# Altium schematic sheet MagicWandFinal.SchDoc
size A4; SheetNumber: 1; SheetTotal: 1
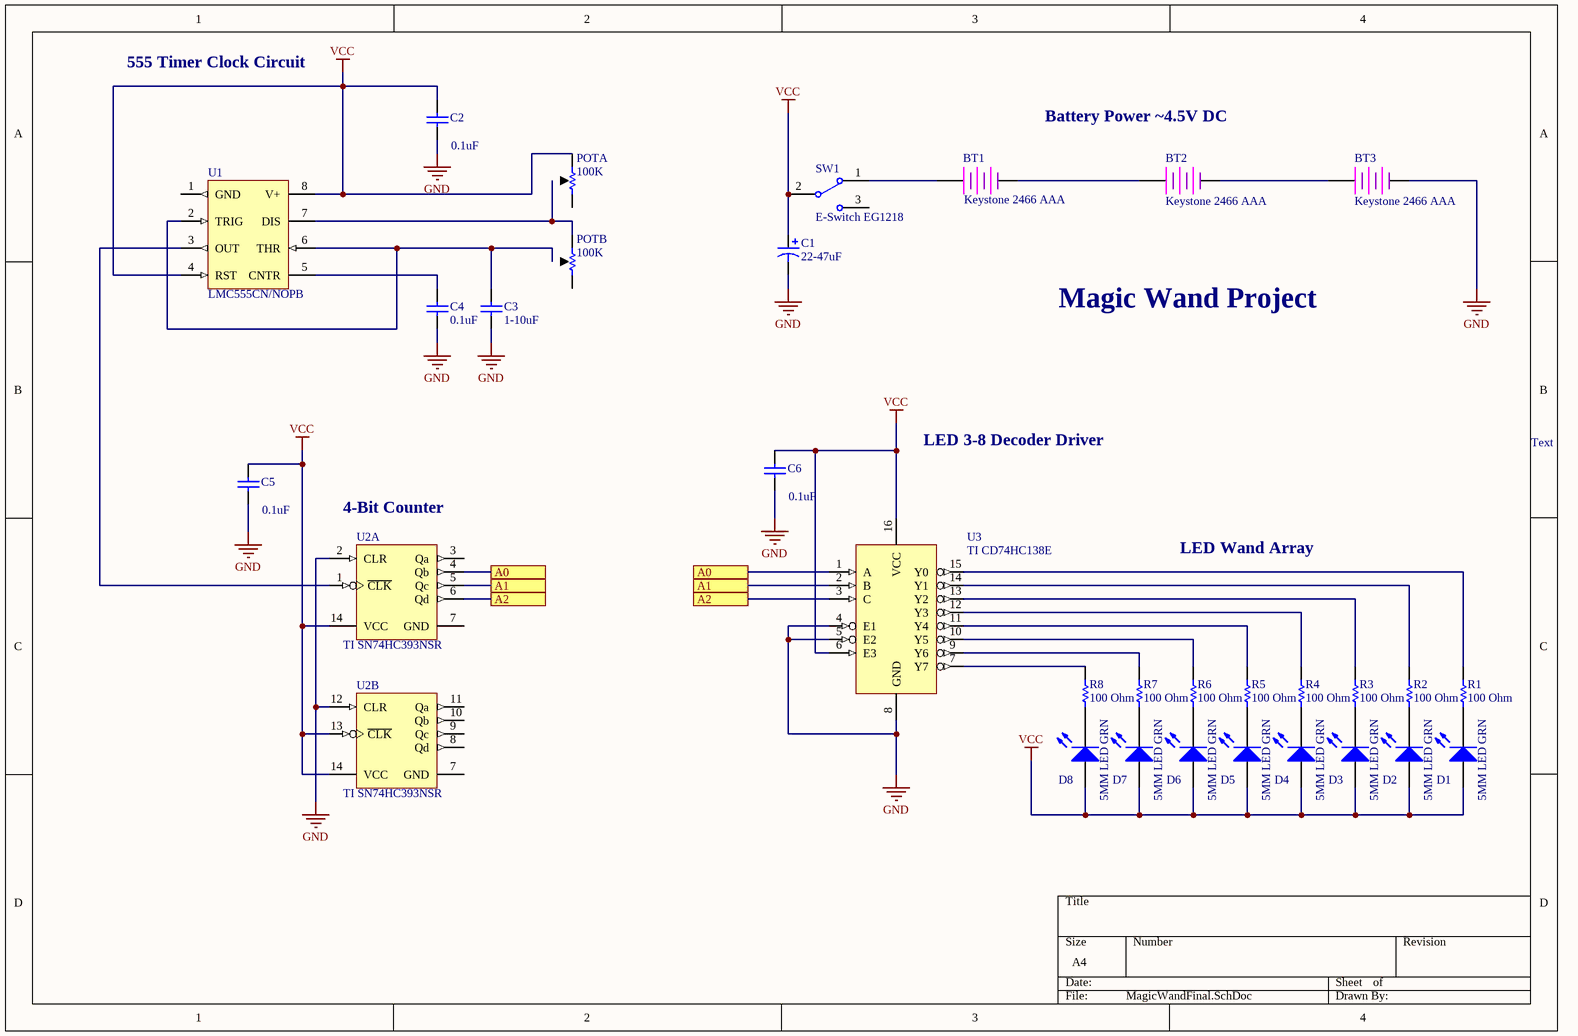
[diagram p0: MagicWandFinal.SchDoc]

## Parts
BT1  Keystone 2466 AAA  [PCB-2466]
BT2  Keystone 2466 AAA  [PCB-2466]
BT3  Keystone 2466 AAA  [PCB-2466]
C1  22-47uF  [PCB-nq6yd78wv7rl8ojp8omb-1]
C2  0.1uF  [PCB-ql28fbuo3tond8refhb5-1]
C3  1-10uF  [PCB-ql28fbuo3tond8refhb5-1]
C4  0.1uF  [PCB-ql28fbuo3tond8refhb5-1]
C5  0.1uF  [PCB-ql28fbuo3tond8refhb5-1]
C6  0.1uF  [PCB-ql28fbuo3tond8refhb5-1]
D1  5MM LED GRN  [PCB-b5vk7vz0xhkw7l0fnova-1]
D2  5MM LED GRN  [PCB-b5vk7vz0xhkw7l0fnova-1]
D3  5MM LED GRN  [PCB-b5vk7vz0xhkw7l0fnova-1]
D4  5MM LED GRN  [PCB-b5vk7vz0xhkw7l0fnova-1]
D5  5MM LED GRN  [PCB-b5vk7vz0xhkw7l0fnova-1]
D6  5MM LED GRN  [PCB-b5vk7vz0xhkw7l0fnova-1]
D7  5MM LED GRN  [PCB-b5vk7vz0xhkw7l0fnova-1]
D8  5MM LED GRN  [PCB-b5vk7vz0xhkw7l0fnova-1]
POTA  100K  [PCB-yu8b13vw5bhotm5v9joo-1]
POTB  100K  [PCB-yu8b13vw5bhotm5v9joo-1]
R1  100 Ohm  [PCB-0jk5y5qyb1smy9vf6b7t-1]
R2  100 Ohm  [PCB-0jk5y5qyb1smy9vf6b7t-1]
R3  100 Ohm  [PCB-0jk5y5qyb1smy9vf6b7t-1]
R4  100 Ohm  [PCB-0jk5y5qyb1smy9vf6b7t-1]
R5  100 Ohm  [PCB-0jk5y5qyb1smy9vf6b7t-1]
R6  100 Ohm  [PCB-0jk5y5qyb1smy9vf6b7t-1]
R7  100 Ohm  [PCB-0jk5y5qyb1smy9vf6b7t-1]
R8  100 Ohm  [PCB-0jk5y5qyb1smy9vf6b7t-1]
SW1  E-Switch EG1218  [ESWI-EG1218_V]
U1  LMC555CN/NOPB  [TI-D8_L]
U2  TI SN74HC393NSR  [SOIC-SL14_N]  (parts A,B of 2)
U3  TI CD74HC138E  [PCB-iqyivjlmuk83cucpld0n-1]

## Ports
A0, A1, A2

## Nets
GND: BT3.2(-) C1.2 C2.1 C3.1 C4.1 C5.1 C6.1 U2.2(CLR) U2.12(CLR) U3.4(E1) U3.5(E2) U3.8(GND)
VCC: C1.1 C2.2 C5.2 C6.2 D1.2(A) D2.2(A) D3.2(A) D4.2(A) D5.2(A) D6.2(A) D7.2(A) D8.2(A) POTA.1 SW1.2(COM) U1.4(RST) U1.8(V+) U2.13(~{CLK}) U2.14(VCC) U3.6(E3) U3.16(VCC)
A0: U2.4(Qb) U3.1(A) ; port A0
A1: U2.5(Qc) U3.2(B) ; port A1
A2: U2.6(Qd) U3.3(C) ; port A2
NetBT1_1: BT1.1(+) SW1.1
NetBT1_2: BT1.2(-) BT2.1(+)
NetBT2_2: BT2.2(-) BT3.1(+)
NetC3_2: C3.2 POTB.2 U1.2(TRIG) U1.6(THR)
NetC4_2: C4.2 U1.5(CNTR)
NetD1_1: D1.1(K) R1.1
NetD2_1: D2.1(K) R2.1
NetD3_1: D3.1(K) R3.1
NetD4_1: D4.1(K) R4.1
NetD5_1: D5.1(K) R5.1
NetD6_1: D6.1(K) R6.1
NetD7_1: D7.1(K) R7.1
NetD8_1: D8.1(K) R8.1
NetPOTA_2: POTA.2 POTB.1 U1.7(DIS)
NetR1_2: R1.2 U3.15(Y0)
NetR2_2: R2.2 U3.14(Y1)
NetR3_2: R3.2 U3.13(Y2)
NetR4_2: R4.2 U3.12(Y3)
NetR5_2: R5.2 U3.11(Y4)
NetR6_2: R6.2 U3.10(Y5)
NetR7_2: R7.2 U3.9(Y6)
NetR8_2: R8.2 U3.7(Y7)
NetU1_3: U1.3(OUT) U2.1(~{CLK})

Not connected (* = marked no-connect by the designer): POTA 3; POTB 3; SW1 3; U1 1(GND); U2 3(Qa) 7(GND) 8(Qd) 9(Qc) 10(Qb) 11(Qa)

## Notes on the sheet
- 555 Timer Clock Circuit
- Battery Power ~4.5V DC
- Magic Wand Project
- LED 3-8 Decoder Driver
- Text
- (near U2) 4-Bit Counter
- LED Wand Array

## Library data of the parts
BT1-BT3 = CMP-3612-8: Battery holder, AAA, 1 cell, PC mount
C1 = CMP-119dd9bbe86bce5a-2: Cap Aluminum 10uF 16V 20% (4 X 7mm) Cylindrical 18mA 7000 hr 105°C T/R; Manufacturer Part Number: UCB1C100MCL1GS; Voltage Rating (DC): 16.0 V; Capacitance: 10.0 F; Capacitance Tolerance: ±20%; Size-Diameter: 4.00 mm; Packaging: Tape & Reel (TR); RoHS: Compliant; Octopart URL: http://octopart.com/ucb1c100mcl1gs-nichicon-19717264; OctopartID: 119dd9bbe86bce5a; Size-Height: 7.00 mm; Mounting Style: Surface Mount
C2-C6 = CMP-1272d9258f2acdb5-7: K 100nF Ceramic Multilayer Capacitor, 50 V dc, +125degC, X7R Dielectric, +/-10%
D1-D8 = CMP-92bb5b2eff764d7c-3: LED Uni-Color Green 2-Pin T-1 3/4 Bulk; Manufacturer Part Number: C503B-GCN-CY0C0791; Manufacturer: Cree; Wavelength: 527 nm; Luminous Intensity: 12.5 cd; Viewing Angle: 30 °; Forward Voltage: 3.20 V; Octopart URL: http://octopart.com/c503b-gcn-cy0c0791-cree-10438827; OctopartID: 92bb5b2eff764d7c; RoHS: Compliant; Color: Green; Mounting Style: Through Hole; Number of Pins: 2
POTA POTB = CMP-1c6ed013efbec3a9-1: Res Cermet Trimmer 200K Ohm 10% 1/2W 1(Elec)/1(Mech)Turn 2.6mm (7 X 7 X 5.8mm) Pin Thru-Hole Bulk; Manufacturer Part Number: CT-6EP204; Lead-Free Status: Lead Free; Power Rating: 500 mW; Resistance: 200 kΩ; Temperature Coefficient: -100 ppm/°C to 100 ppm/°C; RoHS: Compliant; Resistance Tolerance: ±10%; Color: Blue; Weight: 510 mg; Packaging: Bulk; OctopartID: 1c6ed013efbec3a9; Operating Temperature: 120 °C (max); Size-Length: 7.00 mm; Size-Width: 7.00 mm; Mounting Style: Through Hole; Octopart URL: https://octopart.com/ct-6ep204-nidec+copal-91739830; Size-Height: 5.80 mm
R1-R8 = CMP-db3e1311f37e04f9-11: Res, 1K, 250mW, 5%, Axial
SW1 = CMP-9a5a5340a2f5459d-9: Slide Switch, 500 V, -20 to 70 degC, 3-Pin THD, RoHS; Contacts Type: SPDT; Current Rating: 200 mA; Lead-Free Status: Lead Free; Actuator Type: Standard; Number of Positions: 2; Contact Plating: Silver; Mounting Style: PCB, Through Hole; DatasheetVersion: Oct-15; Size-Height: 5.40 mm; Seller Landing  Url: https://octopart-clicks.com/click/track?country=US&ak=8157f166&sig=0e9adab&sid=459&ppid=1056201&vpid=1179261&ct=offers; Size-Width: 4.00 mm; OctopartID: 9a5a5340a2f5459d; RoHS: Compliant; Contact Material: Copper Alloy; Manufacturer Part Number: EG1218; Orientation: Vertical; PackageReference: EG1218; Octopart Url: http://octopart.com/eg1218-e-switch-1056201; Size-Length: 2.03 mm; PackageDescription: 3-Pin Through Hole Device, Body 11.6 x 4 mm, Pitch 2.5 mm; Packaging: Bulk
U1 = CMP-6f1ca76cec01b0db-1: World’s smallest 555 timer with low power, high accuracy and a Fmax of 3MHz 8-SOIC -40 to 85; Manufacturer Part Number: LMC555CMX/NOPB; Supply Voltage (DC): 1.50 V (min), 2.00 V (min), 15.0 V (max); Frequency: 3.00 MHz; Input Voltage (DC): 12.0 V (max); Output Current: 100 mA (max); Lead-Free Status: Lead Free; Quiescent Current: 50.0 µA; Footprint: PCC-0151-00063-2; Case/Package: SOIC; RoHS: Compliant; Octopart URL: https://octopart.com/lmc555cmx%2Fnopb-texas+instruments-24815227; Number of Pins: 8; Mounting Style: Surface Mount; OctopartID: 6f1ca76cec01b0db; REACH SVHC Compliance: No SVHC; Operating Temperature: -40.0 °C (min); Packaging: Cut Tape (CT), Reel, Tape & Reel (TR); Lifecycle Status: Active
U2 = CMP-3cf3f5f3f6c2e334-2: Counter/Divider Dual 4-Bit Binary UP 14-Pin SOP T/R   SMD; Voltage Nodes: 2.00 V, 5.00 V, 6.00 V; Number of Bits: 4; Output Current Drive: -1.00 mA; Clock Speed: 60.0 MHz; Supply Voltage (DC): 2.00 V to 6.00 V; Lead-Free Status: Lead Free; Packaging: Reel; Lifecycle Status: Active; Operating Temperature: -40.0 °C to 85.0 °C; Footprint: PCC-0016-00091-1; Number of Pins: 14; Manufacturer Part Number: SN74HC393NSR; OctopartID: 3cf3f5f3f6c2e334; Mounting Style: Surface Mount; RoHS: Compliant; Octopart URL: https://octopart.com/sn74hc393nsr-texas+instruments-716631; Case/Package: SOP
U3 = CMP-1166716-8: TEXAS INSTRUMENTS   CD74HC138E   Logic Type:Decoder / Demultiplexer; Propagation Delay: 265 ns; Output Current: 5.2 mA; Lead-Free Status: Lead Free; Operating Supply Voltage: 2 V to 6 V; Number of Bits: 8; Number of Circuits: 1; Operating Supply Voltage (typical): 2.5V / 3.3V / 5.0V; Octopart Url: https://octopart.com/cd74hc138e-harris-4046706; REACH SVHC Compliance: No SVHC; Operating Temperature: -55C to 125C; Package: PDIP; Manufacturer: Texas Instruments; Mounting Style: Through Hole; Number of Outputs: 8; RoHS: Compliant; Packaging: Tube; Manufacturer Part Number: CD74HC138E; OctopartID: 2c46e54acdf8f381; Number of Pins: 16; Lifecycle Status: Active